# Altium project SmartSwitchV3.PrjPcb
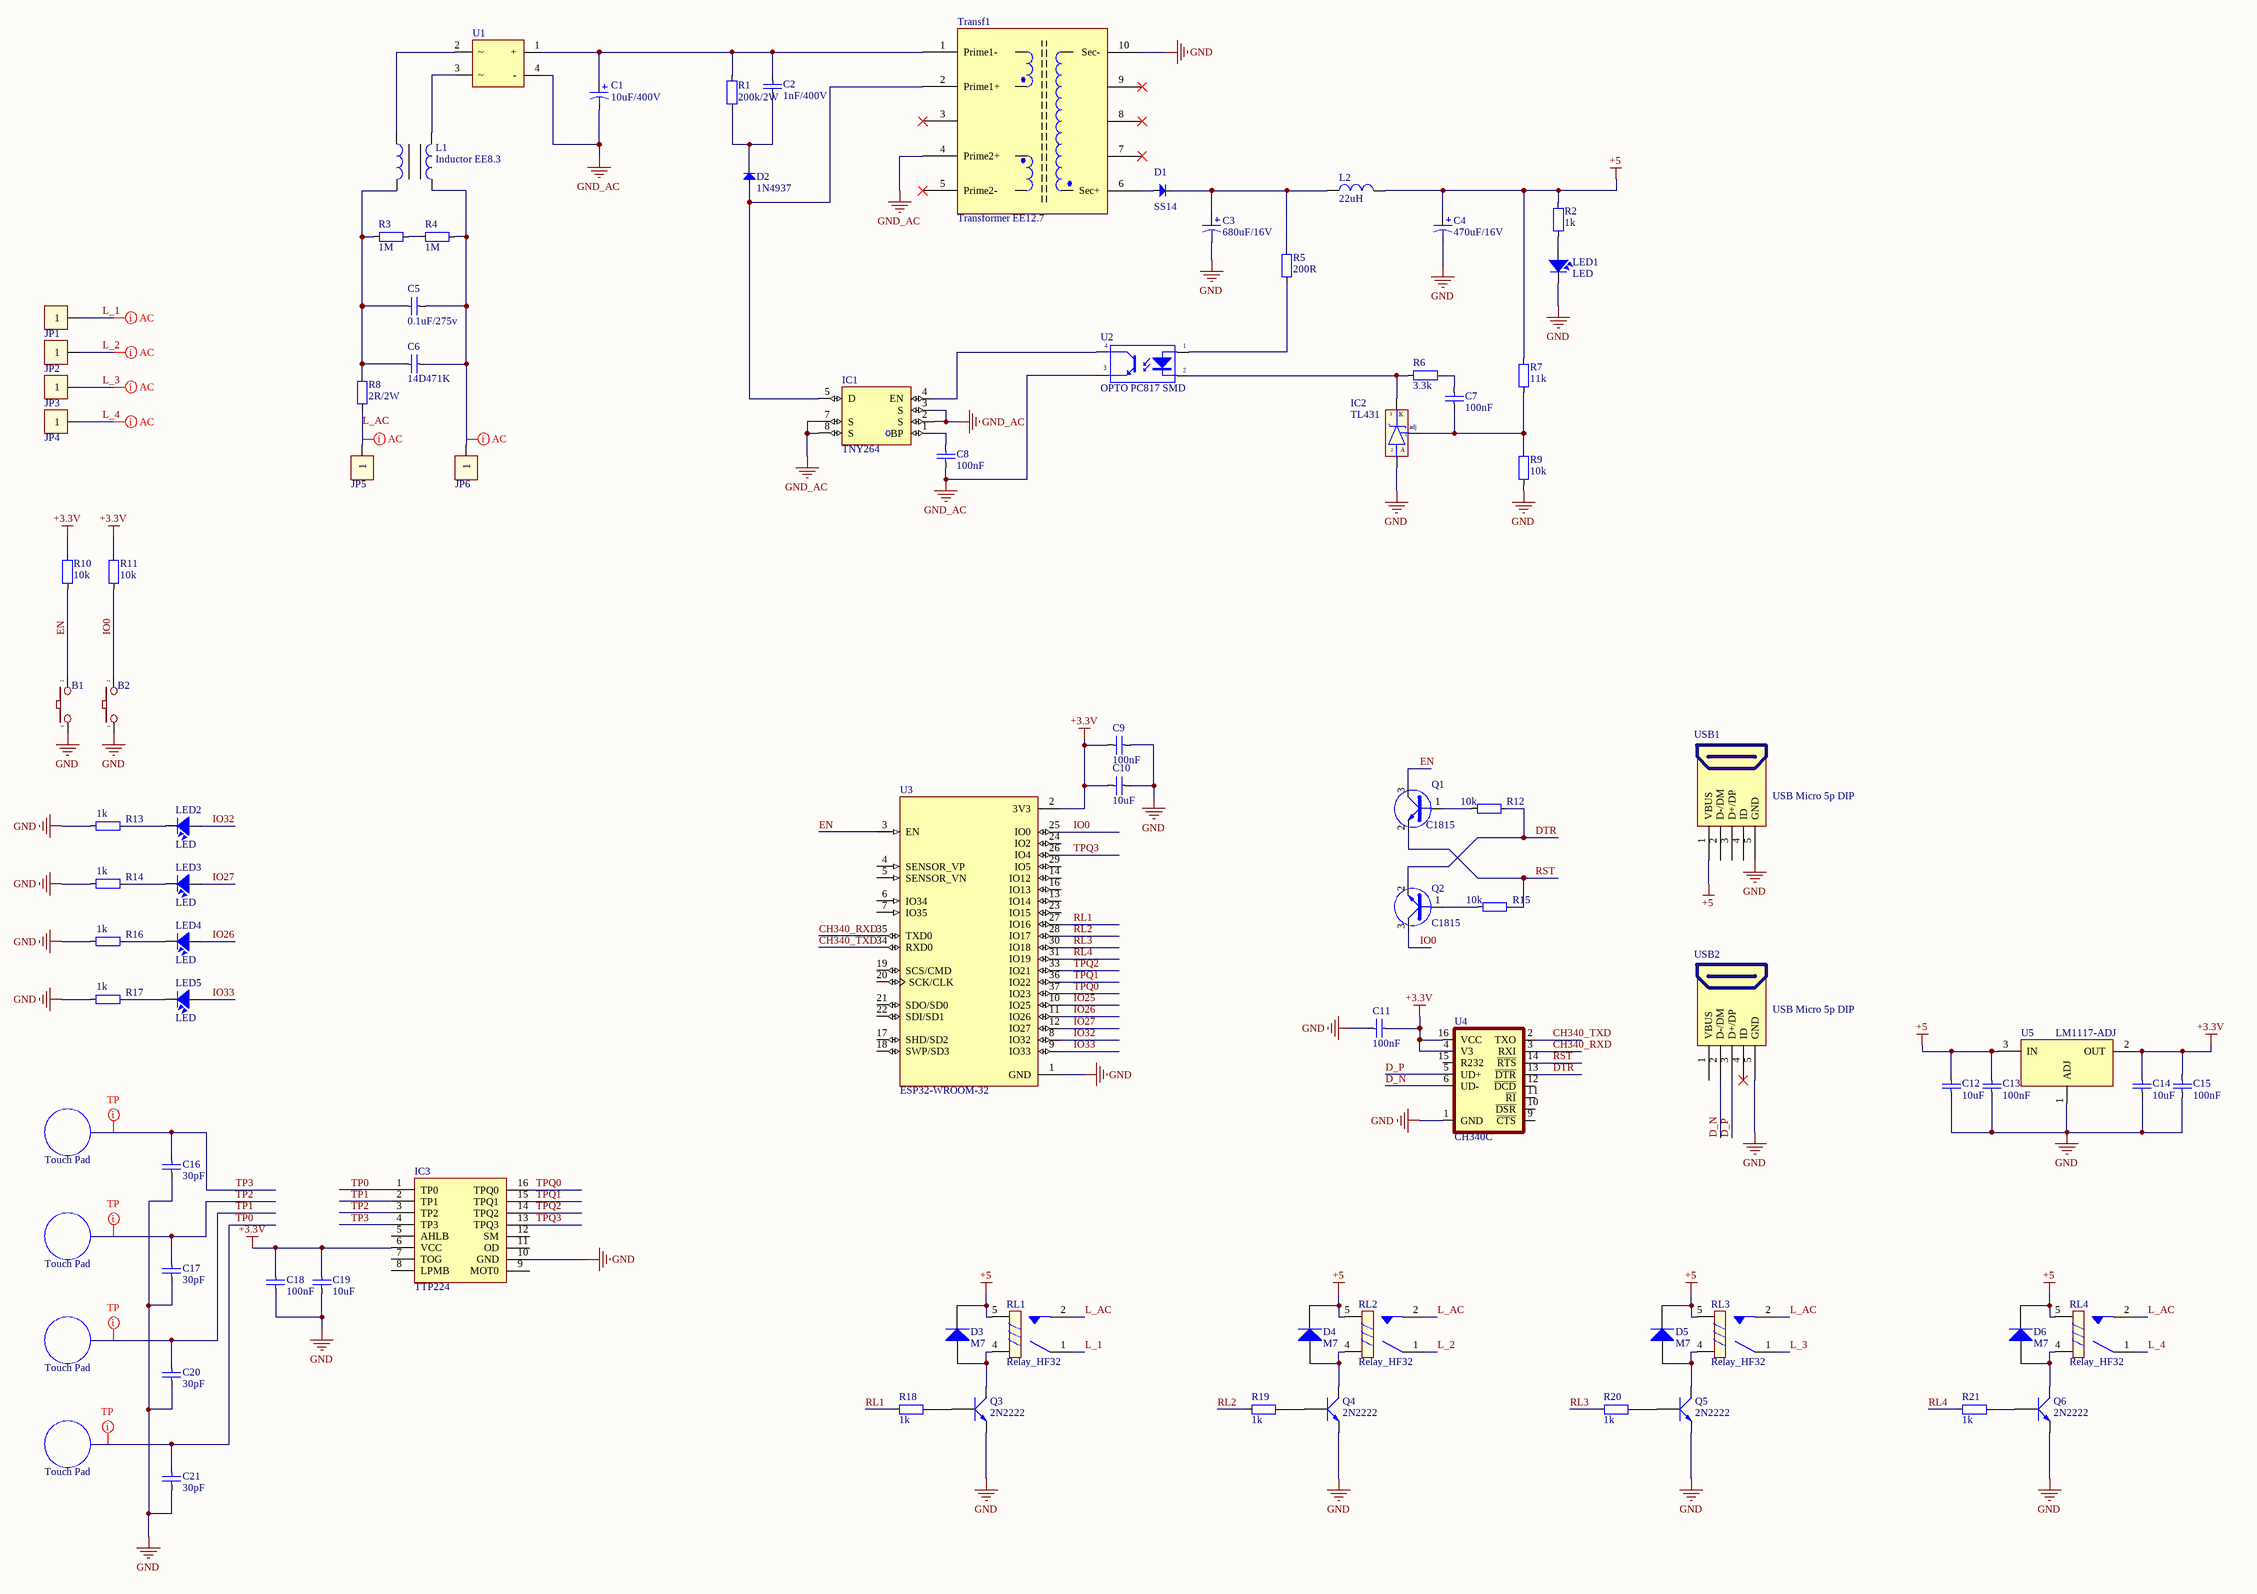
[diagram p0: SmartSwitchV3.SchDoc]
1 sheet, 84 parts. Net scope: global (net labels, ports and power ports of the same name join across sheets).
Board file: SmartSwitchV3.PcbDoc

## Sheet SmartSwitchV3.SchDoc
size A2; SheetNumber: 1; SheetTotal: 1

### Parts
B1  Button 3x4x2.5  [Button 3x4x2.5]  (value not drawn)
B2  Button 3x4x2.5  [Button 3x4x2.5]  (value not drawn)
C1  10uF/400V  [C10mm]
C2  1nF/400V  [103/2KV]
C3  680uF/16V  [C8mm]
C4  470uF/16V  [C8mm]
C5  0.1uF/275v  [Cap AC filter]
C6  14D471K  [103/2KV]
C7  100nF  [CAP_0805]
C8  100nF  [CAP_0805]
C9  100nF  [CAP_0805]
C10  10uF  [CAP_0805]
C11  100nF  [CAP_0805]
C12  10uF  [CAP_0805]
C13  100nF  [CAP_0805]
C14  10uF  [CAP_0805]
C15  100nF  [CAP_0805]
C16  30pF  [CAP_0805]
C17  30pF  [CAP_0805]
C18  100nF  [CAP_0805]
C19  10uF  [CAP_0805]
C20  30pF  [CAP_0805]
C21  30pF  [CAP_0805]
D1  SS14  [DO-214AA(SMB)]
D2  1N4937  [DIO-1AN]
D3  M7  [DIODE SMA]
D4  M7  [DIODE SMA]
D5  M7  [DIODE SMA]
D6  M7  [DIODE SMA]
IC1  TNY264  [TNY264]
IC2  TL431  [qto-92]
IC3  TTP224  [TTP224]
JP1  Coc_dong  [Coc_dong]  (value not drawn)
JP2  Coc_dong  [Coc_dong]  (value not drawn)
JP3  Coc_dong  [Coc_dong]  (value not drawn)
JP4  Coc_dong  [Coc_dong]  (value not drawn)
JP5  Coc_dong  [Coc_dong]  (value not drawn)
JP6  Coc_dong  [Coc_dong]  (value not drawn)
L1  Inductor EE8.3  [Inductor EE8.3]
L2  22uH  [L_SMD]
LED1  LED  [LED-0805-Red]
LED2  LED  [LED-0805-Red]
LED3  LED  [LED-0805-Red]
LED4  LED  [LED-0805-Red]
LED5  LED  [LED-0805-Red]
Q1  C1815  [SOT23D]
Q2  C1815  [SOT23D]
Q3  2N2222  [SOT23]
Q4  2N2222  [SOT23]
Q5  2N2222  [SOT23]
Q6  2N2222  [SOT23]
R1  200k/2W  [RES-1WW]
R2  1k  [RES-SMD-0805]
R3  1M  [RES-SMD-1206]
R4  1M  [RES-SMD-1206]
R5  200R  [RES-SMD-0805]
R6  3.3k  [RES-SMD-0805]
R7  11k  [RES-SMD-0805]
R8  2R/2W  [RES-1WW]
R9  10k  [RES-SMD-0805]
R10  10k  [RES-SMD-0805]
R11  10k  [RES-SMD-0805]
R12  10k  [RES-SMD-0805]
R13  1k  [RES-SMD-0805]
R14  1k  [RES-SMD-0805]
R15  10k  [RES-SMD-0805]
R16  1k  [RES-SMD-0805]
R17  1k  [RES-SMD-0805]
R18  1k  [RES-SMD-0805]
R19  1k  [RES-SMD-0805]
R20  1k  [RES-SMD-0805]
R21  1k  [RES-SMD-0805]
RL1  Relay_HF32  [HF32F]
RL2  Relay_HF32  [HF32F]
RL3  Relay_HF32  [HF32F]
RL4  Relay_HF32  [HF32F]
Transf1  Transformer EE12.7  [Transformer EE12.7]
U1  Diode Bridge Flate  [DB207S]  (value not drawn)
U2  OPTO PC817 SMD  [SOP4]
U3  ESP32-WROOM-32  [MODULE_ESP32-WROOM-32]
U4  CH340C  [SO016]
U5  LM1117-ADJ  [LM1117-SOP]
USB1  USB Micro 5p DIP  [USB Micro 5p DIP]
USB2  USB Micro 5p DIP  [USB Micro 5p DIP]

### Nets
+3.3V: C9.1 C10.1 C11.1 C14.1 C15.1 C18.2 C19.2 IC3.6(VCC) R10.1 R11.1 U3.2(3V3) U4.4(V3) U4.16(VCC) U5.2(OUT)
+5: C4.1 C12.1 C13.1 D3.2(K) D4.2(K) D5.2(K) D6.2(K) L2.2 R2.2 R7.2 RL1.5 RL2.5 RL3.5 RL4.5 U5.3(IN) USB1.1(VBUS)
GND: B1.1 B2.1 C3.2 C4.2 C9.2 C10.2 C11.2 C12.2 C13.2 C14.2 C15.2 C16.1 C17.1 C18.1 C19.1 C20.1 C21.1 IC2.2(A) IC3.10(GND) LED1.2 Q3.2(E) Q4.2(E) Q5.2(E) Q6.2(E) R9.1 R13.2 R14.2 R16.2 R17.2 Transf1.10(Sec-) U3.1(GND) U4.1(GND) U5.1(ADJ) USB1.5(GND) USB2.5(GND)
GND_AC: C1.2 C8.1 IC1.2(S) IC1.3(S) IC1.7(S) IC1.8(S) Transf1.4(Prime2+) U1.4(-) U2.3(E)
CH340_RXD: U3.35(TXD0) U4.3(RXI)
CH340_TXD: U3.34(RXD0) U4.2(TXO)
D_N: U4.6(UD-) USB2.2(D-/DM)
D_P: U4.5(UD+) USB2.3(D+/DP)
DTR: Q2.2(E) R12.1 U4.13(~{DTR})
EN: B1.2 Q1.3(C) R10.2 U3.3(EN)
IO0: B2.2 Q2.3(C) R11.2 U3.25(IO0)
IO25: U3.10(IO25)
IO26: LED4.1 U3.11(IO26)
IO27: LED3.1 U3.12(IO27)
IO32: LED2.1 U3.8(IO32)
IO33: LED5.1 U3.9(IO33)
L_1: JP1.1 RL1.1
L_2: JP2.1 RL2.1
L_3: JP3.1 RL3.1
L_4: JP4.1 RL4.1
L_AC: JP5.1 R8.1 RL1.2 RL2.2 RL3.2 RL4.2
RL1: R18.1 U3.27(IO16)
RL2: R19.1 U3.28(IO17)
RL3: R20.1 U3.30(IO18)
RL4: R21.1 U3.31(IO19)
RST: Q1.2(E) R15.1 U4.14(~{RTS})
TP0: C21.2 IC3.1(TP0)
TP1: C20.2 IC3.2(TP1)
TP2: C17.2 IC3.3(TP2)
TP3: C16.2 IC3.4(TP3)
TPQ0: IC3.16(TPQ0) U3.37(IO23)
TPQ1: IC3.15(TPQ1) U3.36(IO22)
TPQ2: IC3.14(TPQ2) U3.33(IO21)
TPQ3: IC3.13(TPQ3) U3.26(IO4)
NetC1_1: C1.1 C2.1 R1.2 Transf1.1(Prime1-) U1.1(+)
NetC2_2: C2.2 D2.2(K) R1.1
NetC3_1: C3.1 D1.2(K) L2.1 R5.2
NetC5_1: C5.1 C6.1 JP6.1 L1.4 R4.1
NetC5_2: C5.2 C6.2 L1.2 R3.2 R8.2
NetC7_1: C7.1 IC2.1(adj) R7.1 R9.2
NetC7_2: C7.2 R6.1
NetC8_2: C8.2 IC1.1(BP)
NetD1_1: D1.1(A) Transf1.6(Sec+)
NetD2_1: D2.1(A) IC1.5(D) Transf1.2(Prime1+)
NetD3_1: D3.1(A) Q3.3(C) RL1.4
NetD4_1: D4.1(A) Q4.3(C) RL2.4
NetD5_1: D5.1(A) Q5.3(C) RL3.4
NetD6_1: D6.1(A) Q6.3(C) RL4.4
NetIC1_4: IC1.4(EN) U2.4(C)
NetIC2_3: IC2.3(K) R6.2 U2.2(K)
NetL1_1: L1.1 U1.2
NetL1_3: L1.3 U1.3
NetLED1_1: LED1.1 R2.1
NetLED2_2: LED2.2 R13.1
NetLED3_2: LED3.2 R14.1
NetLED4_2: LED4.2 R16.1
NetLED5_2: LED5.2 R17.1
NetQ1_1: Q1.1(B) R12.2
NetQ2_1: Q2.1(B) R15.2
NetQ3_1: Q3.1(B) R18.2
NetQ4_1: Q4.1(B) R19.2
NetQ5_1: Q5.1(B) R20.2
NetQ6_1: Q6.1(B) R21.2
NetR3_1: R3.1 R4.2
NetR5_1: R5.1 U2.1(A)

Not connected (* = marked no-connect by the designer): IC3 5(AHLB) 7(TOG) 8(LPMB) 9(MOT0) 11(OD) 12(SM); Transf1 3* 5(Prime2-)* 7* 8* 9*; U3 4(SENSOR_VP) 5(SENSOR_VN) 6(IO34) 7(IO35) 13(IO14) 14(IO12) 16(IO13) 17(SHD/SD2) 18(SWP/SD3) 19(SCS/CMD) 20(SCK/CLK) 21(SDO/SD0) 22(SDI/SD1) 23(IO15) 24(IO2) 29(IO5); U4 9(~{CTS}) 10(~{DSR}) 11(~{RI}) 12(~{DCD}) 15(R232); USB1 2(D-/DM) 3(D+/DP) 4(ID); USB2 1(VBUS) 4(ID)*

### Layout directives
net class AC: L_1, L_2, L_3, L_4, L_AC, NetC5_1
net class TP: TP0, TP1, TP2, TP3

### Notes on the sheet
- Touch Pad

### Library data of the parts
C1 C3 C4 = Cap Pol: Polarized Capacitor (Axial); Published: 8-Jun-2000; LatestRevisionDate: 17-Jul-2002; LatestRevisionNote: Re-released for DXP Platform.; PackageReference: POLAR0.8; Publisher: Altium Limited
C2 = Cap2KV: CAP CERAMIC; Published: 8-Jun-2000; LatestRevisionDate: 17-Jul-2002; LatestRevisionNote: Re-released for DXP Platform.; PackageReference: RAD-0.3; Publisher: Altium Limited
C5 = Cap AC filter: Tụ lọc nguồn AC 0.1uf 275v 10mm
C6 = Cap2KV: Capacitor Ceramic 2KV; Published: 8-Jun-2000; LatestRevisionDate: 17-Jul-2002; LatestRevisionNote: Re-released for DXP Platform.; PackageReference: RAD-0.3; Publisher: Altium Limited
C7-C21 = CapSMD: Capacitor; Value: 33p; Published: 8-Jun-2000; LatestRevisionDate: 17-Jul-2002; LatestRevisionNote: Re-released for DXP Platform.; PackageReference: RAD-0.3; Publisher: Altium Limited
D1 = Diode SMD: Diode Schottky / 1N5819; Code - JEDEC: DO-214-AB; Value: 1N5007; Published: 8-Jun-2000; Revision: July-2002: Re-released for DXP Platform.; Publisher: Altium Limited
D2 = Diode SMD: Diode Schottky / 1N4937; Code - JEDEC: DO-214-AB; Value: 1N5007; Published: 8-Jun-2000; Revision: July-2002: Re-released for DXP Platform.; Publisher: Altium Limited
D3-D6 = Diode M7 ( 4007 ): Dán; Don_Vi: Con; Ten_Linh_Kien: Diode M7 1N4007 SMD 1A 1000V; Ma_Hang: MH000944; Chung_Loai: Dán; Ghi_Chu: *
IC1 = TNY264: IC Power
IC2 = TL431: Programmable Shunt Regulator; Value: TL431
L2 = Inductor: CD73R 22uH 1.23A 7345; Value: 150 mH
LED1-LED5 = LED: LED Single colour Green and Red; Value: LED 3 ly Single Colour
Q1 Q2 = 2SC1815: NPN 600mW, ECB; Value: C1815
Q3-Q6 = C1815 HF SMD: NPN transistor; Value: C9014
R1-R21 = Resistor - SMD: Resistor; Manufacturer: Generic Components; Class: Passive; Published: 08/06/2000; Publisher: Altium Hobart Technology Centre
Transf1 = Tranformer EE16
U1 = Diode Bridge Flate: Diode Bridge
U2 = OPTO PC817 SMD: Single Opto; Value: PC817
U3 = ESP32-WROOM-32: Bluetooth, WiFi Transceiver Module 2.4GHz ~ 2.5GHz Surface Mount; MF: Espressif Systems; Package: Module Espressif Systems; Digi-Key_Part_Number: 1904-1010-1-ND; Digi-Key_Purchase_URL: https://www.digikey.com/product-detail/en/espressif-systems/ESP32-WROOM-32/1904-1010-1-ND/8544305?utm_source=snapeda&utm_medium=aggregator&utm_campaign=symbol; Value: *; MP: ESP32-WROOM-32; SnapEDA_Link: https://www.snapeda.com/parts/ESP32-WROOM-32/Espressif%20Systems/view-part/2753322/?ref=snap
U4 = CH340C: USB to serial chip CH340; MF: WCH; Package: Package; Check_prices: https://www.snapeda.com/parts/CH340C/WCH/view-part/5428851/?ref=eda; Value: *; Price: None; MP: CH340C; Availability: Unavailable; SnapEDA_Link: https://www.snapeda.com/parts/CH340C/WCH/view-part/5428851/?ref=snap
U5 = LM1117-ADJ: 800mA Low-Dropout Linear Regulator; Creator: Nguyen Ba Bien; Website: http://group3i.net
USB1 USB2 = USB Micro 5p DIP: USB Type B; Ten: MicroUSB MK5P DIP; Ma_Hang: MH005145